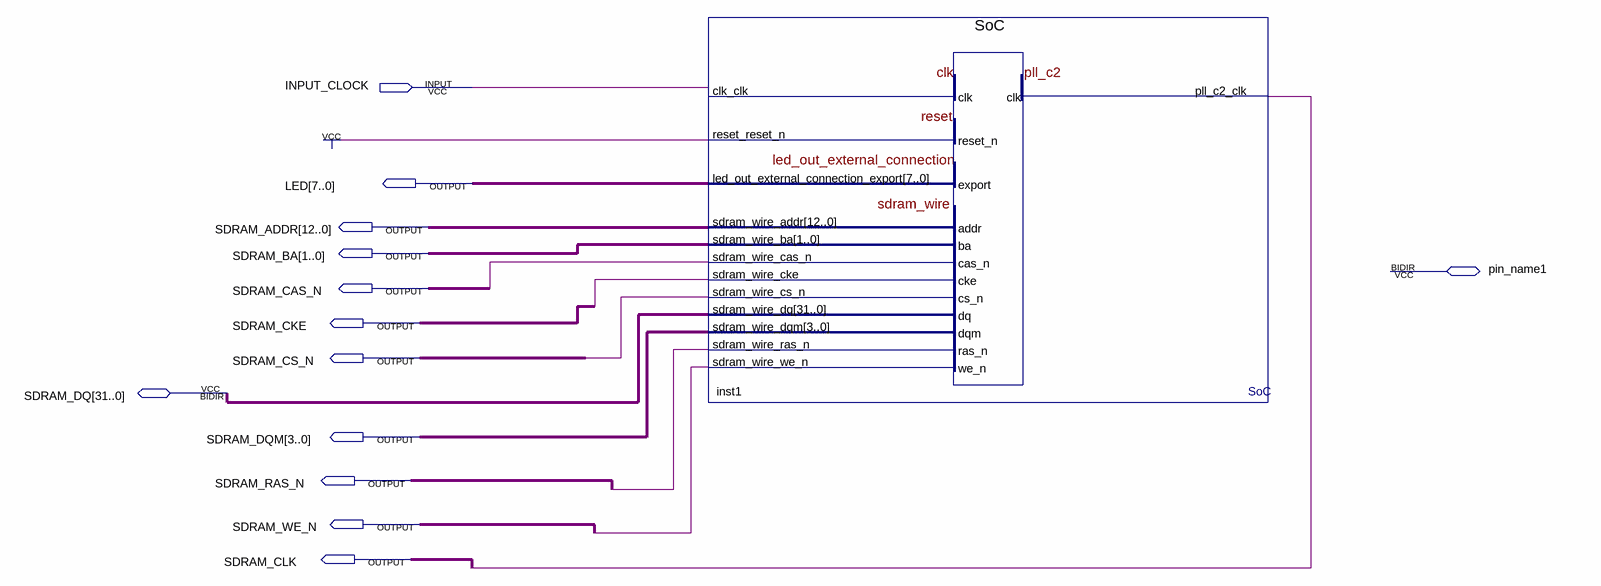
[diagram p0: schematic sheet]
// Quartus schematic TopLevel.bdf as structural Verilog: 1 symbols, 13 pins
module TopLevel (
  input  INPUT_CLOCK,
  inout  pin_name1,
  inout  [31:0] SDRAM_DQ,
  output [7:0] LED,
  output [12:0] SDRAM_ADDR,
  output [1:0] SDRAM_BA,
  output SDRAM_CAS_N,
  output SDRAM_CKE,
  output SDRAM_CS_N,
  output [3:0] SDRAM_DQM,
  output SDRAM_RAS_N,
  output SDRAM_WE_N,
  output SDRAM_CLK
);

  SoC inst1 (
    .clk_clk(INPUT_CLOCK), .reset_reset_n(1'b1), .led_out_external_connection_export(LED),
    .pll_c2_clk(SDRAM_CLK), .sdram_wire_addr(SDRAM_ADDR), .sdram_wire_ba(SDRAM_BA),
    .sdram_wire_cas_n(SDRAM_CAS_N), .sdram_wire_cke(SDRAM_CKE), .sdram_wire_cs_n(SDRAM_CS_N),
    .sdram_wire_dqm(SDRAM_DQM), .sdram_wire_ras_n(SDRAM_RAS_N), .sdram_wire_we_n(SDRAM_WE_N),
    .sdram_wire_dq(SDRAM_DQ));
endmodule
